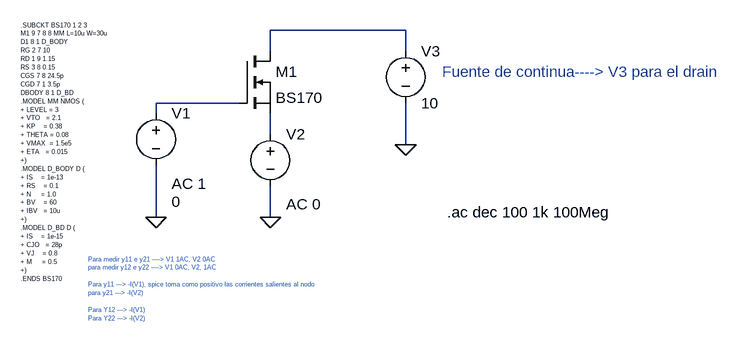
[diagram p0: schematic bonus2_ts5.asc]
bonus2_ts5.asc, the LTspice schematic file:
Version 4.1
SHEET 1 932 1052
WIRE 400 80 192 80
WIRE 192 112 192 80
WIRE 400 112 400 80
WIRE 144 192 16 192
WIRE 16 208 16 192
WIRE 192 240 192 208
WIRE 400 256 400 192
WIRE 16 368 16 288
WIRE 192 368 192 320
FLAG 16 368 0
FLAG 192 368 0
FLAG 400 256 0
SYMBOL nmos 144 112 R0
SYMATTR InstName M1
SYMATTR Value BS170
SYMATTR Prefix X
SYMBOL voltage 16 192 R0
WINDOW 3 24 152 Left 2
WINDOW 123 24 124 Left 2
WINDOW 39 0 0 Left 0
SYMATTR InstName V1
SYMATTR Value 0
SYMATTR Value2 AC 1
SYMBOL voltage 192 224 R0
WINDOW 123 24 124 Left 2
WINDOW 39 0 0 Left 0
SYMATTR InstName V2
SYMATTR Value ""
SYMATTR Value2 AC 0
SYMBOL voltage 400 96 R0
WINDOW 123 0 0 Left 0
WINDOW 39 0 0 Left 0
SYMATTR InstName V3
SYMATTR Value 10
TEXT 456 144 Left 2 ;Fuente de continua----> V3 para el drain
TEXT -192 72 Left 0 !.SUBCKT BS170 1 2 3\nM1 9 7 8 8 MM L=10u W=30u\nD1 8 1 D_BODY\nRG 2 7 10\nRD 1 9 1.15\nRS 3 8 0.15\nCGS 7 8 24.5p\nCGD 7 1 3.5p\nDBODY 8 1 D_BD\n.MODEL MM NMOS (\n+ LEVEL = 3\n+ VTO   = 2.1\n+ KP    = 0.38\n+ THETA = 0.08\n+ VMAX  = 1.5e5\n+ ETA   = 0.015\n+)\n.MODEL D_BODY D (\n+ IS    = 1e-13\n+ RS    = 0.1\n+ N     = 1.0\n+ BV    = 60\n+ IBV   = 10u\n+)\n.MODEL D_BD D (\n+ IS    = 1e-15\n+ CJO   = 28p\n+ VJ    = 0.8\n+ M     = 0.5\n+)\n.ENDS BS170
TEXT 464 360 Left 2 !.ac dec 100 1k 100Meg
TEXT -88 432 Left 0 ;Para medir y11 e y21 ----> V1 1AC, V2 0AC\npara medir y12 e y22 ----> V1 0AC, V2, 1AC\n \nPara y11 ---> -I(V1), spice toma como positivo las corrientes salientes al nodo\npara y21 ---> -I(V2)\n \nPara Y12 ---> -I(V1)\nPara Y22 ---> -I(V2)

The netlist it stands for:
* bonus2_ts5.asc
X§M1 N001 N002 N003 BS170  ; pins D G S
V1 N002 0 0 AC 1
V2 N003 0 AC 0
V3 N001 0 10
* Fuente de continua----> V3 para el drain
.SUBCKT BS170 1 2 3
M1 9 7 8 8 MM L=10u W=30u
D1 8 1 D_BODY
RG 2 7 10
RD 1 9 1.15
RS 3 8 0.15
CGS 7 8 24.5p
CGD 7 1 3.5p
DBODY 8 1 D_BD
.MODEL MM NMOS (
+ LEVEL = 3
+ VTO   = 2.1
+ KP    = 0.38
+ THETA = 0.08
+ VMAX  = 1.5e5
+ ETA   = 0.015
+)
.MODEL D_BODY D (
+ IS    = 1e-13
+ RS    = 0.1
+ N     = 1.0
+ BV    = 60
+ IBV   = 10u
+)
.MODEL D_BD D (
+ IS    = 1e-15
+ CJO   = 28p
+ VJ    = 0.8
+ M     = 0.5
+)
.ENDS BS170
.ac dec 100 1k 100Meg
* Para medir y11 e y21 ----> V1 1AC, V2 0AC
* para medir y12 e y22 ----> V1 0AC, V2, 1AC
* Para y11 ---> -I(V1), spice toma como positivo las corrientes salientes al nodo
* para y21 ---> -I(V2)
* Para Y12 ---> -I(V1)
* Para Y22 ---> -I(V2)
.backanno
.end